# EAGLE design TIVA_SHIELD_Ver_2.3_AD8032_SOIC (EAGLE 9.6.2)
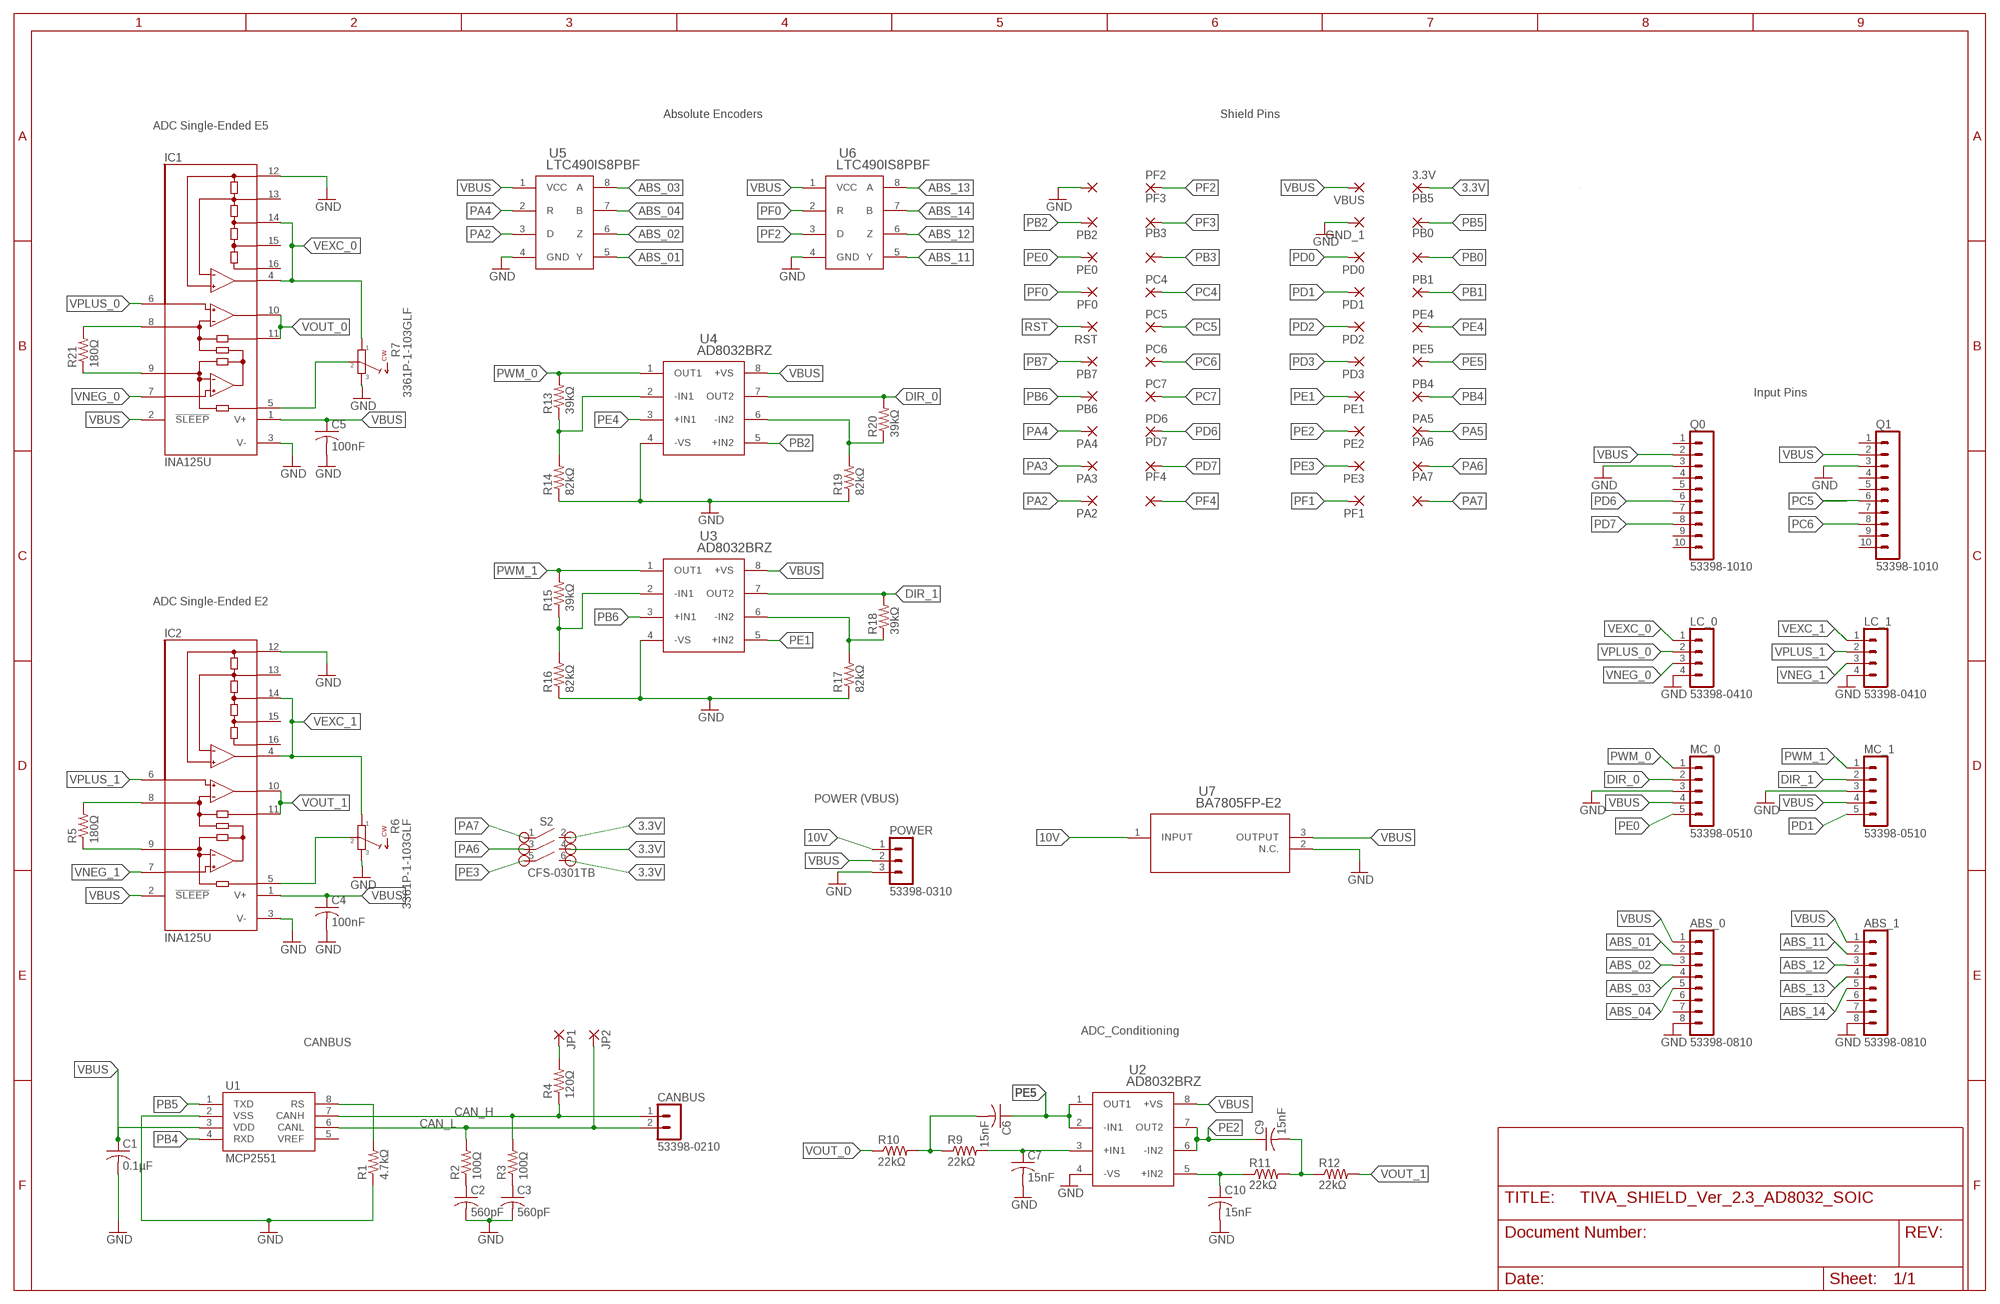
[diagram p0: schematic, sheet 1]

## Parts
3.3V  1,6/0,9  [1,6/0,9]
ABS_0  53398-0810  [53398-0810]
ABS_1  53398-0810  [53398-0810]
C1  0.1µF  C-USC0805  [C0805]
C2  560pF  C-USC0805  [C0805]
C3  560pF  C-USC0805  [C0805]
C4  100nF  C-USC0805  [C0805]
C5  100nF  C-USC0805  [C0805]
C6  15nF  C-USC0805  [C0805]
C7  15nF  C-USC0805  [C0805]
C9  15nF  C-USC0805  [C0805]
C10  15nF  C-USC0805  [C0805]
CANBUS  53398-0210  [53398-0210]
GND_0  1,6/0,9  [1,6/0,9]
GND_1  1,6/0,9  [1,6/0,9]
IC1  INA125U  [SO16-1]
IC2  INA125U  [SO16-1]
JP1  1,6/0,9  [1,6/0,9]
JP2  1,6/0,9  [1,6/0,9]
LC_0  53398-0410  [53398-0410]
LC_1  53398-0410  [53398-0410]
MC_0  53398-0510  [53398-0510]
MC_1  53398-0510  [53398-0510]
PA2  1,6/0,9  [1,6/0,9]
PA3  1,6/0,9  [1,6/0,9]
PA4  1,6/0,9  [1,6/0,9]
PA5  1,6/0,9  [1,6/0,9]
PA6  1,6/0,9  [1,6/0,9]
PA7  1,6/0,9  [1,6/0,9]
PB0  1,6/0,9  [1,6/0,9]
PB1  1,6/0,9  [1,6/0,9]
PB2  1,6/0,9  [1,6/0,9]
PB3  1,6/0,9  [1,6/0,9]
PB4  1,6/0,9  [1,6/0,9]
PB5  1,6/0,9  [1,6/0,9]
PB6  1,6/0,9  [1,6/0,9]
PB7  1,6/0,9  [1,6/0,9]
PC4  1,6/0,9  [1,6/0,9]
PC5  1,6/0,9  [1,6/0,9]
PC6  1,6/0,9  [1,6/0,9]
PC7  1,6/0,9  [1,6/0,9]
PD0  1,6/0,9  [1,6/0,9]
PD1  1,6/0,9  [1,6/0,9]
PD2  1,6/0,9  [1,6/0,9]
PD3  1,6/0,9  [1,6/0,9]
PD6  1,6/0,9  [1,6/0,9]
PD7  1,6/0,9  [1,6/0,9]
PE0  1,6/0,9  [1,6/0,9]
PE1  1,6/0,9  [1,6/0,9]
PE2  1,6/0,9  [1,6/0,9]
PE3  1,6/0,9  [1,6/0,9]
PE4  1,6/0,9  [1,6/0,9]
PE5  1,6/0,9  [1,6/0,9]
PF0  1,6/0,9  [1,6/0,9]
PF1  1,6/0,9  [1,6/0,9]
PF2  1,6/0,9  [1,6/0,9]
PF3  1,6/0,9  [1,6/0,9]
PF4  1,6/0,9  [1,6/0,9]
POWER  53398-0310  [53398-0310]
Q0  53398-1010  [53398-1010]
Q1  53398-1010  [53398-1010]
R1  4.7kΩ  R-US_R0805  [R0805]
R2  100Ω  R-US_R0805  [R0805]
R3  100Ω  R-US_R0805  [R0805]
R4  120Ω  R-US_R0805  [R0805]
R5  180Ω  R-US_R0805  [R0805]
R6  3361P-1-103GLF  3361P-1-103GLFSMD  [3361P-1-103GLF]
R7  3361P-1-103GLF  3361P-1-103GLFSMD  [3361P-1-103GLF]
R9  22kΩ  R-US_R0805  [R0805]
R10  22kΩ  R-US_R0805  [R0805]
R11  22kΩ  R-US_R0805  [R0805]
R12  22kΩ  R-US_R0805  [R0805]
R13  39kΩ  R-US_R0805  [R0805]
R14  82kΩ  R-US_R0805  [R0805]
R15  39kΩ  R-US_R0805  [R0805]
R16  82kΩ  R-US_R0805  [R0805]
R17  82kΩ  R-US_R0805  [R0805]
R18  39kΩ  R-US_R0805  [R0805]
R19  82kΩ  R-US_R0805  [R0805]
R20  39kΩ  R-US_R0805  [R0805]
R21  180Ω  R-US_R0805  [R0805]
RST  1,6/0,9  [1,6/0,9]
S2  CFS-0301TB  CFS-0301TBSMD  [CFS-0301TB]
U1  MCP2551  [SO08]
U2  AD8032BRZ  [R_8_ADI]
U3  AD8032BRZ  [R_8_ADI]
U4  AD8032BRZ  [R_8_ADI]
U5  LTC490IS8PBF  [SO-8_S]
U6  LTC490IS8PBF  [SO-8_S]
U7  BA7805FP-E2  [TO252-3_ROM]
VBUS  1,6/0,9  [1,6/0,9]

## Nets
3.3V: 3.3V.1(P) S2.2 S2.4 S2.6
10V: POWER.1 U7.1(INPUT)
ABS_01: ABS_0.2 U5.5(Y)
ABS_02: ABS_0.3 U5.6(Z)
ABS_03: ABS_0.4 U5.8(A)
ABS_04: ABS_0.5 U5.7(B)
ABS_11: ABS_1.2 U6.5(Y)
ABS_12: ABS_1.3 U6.6(Z)
ABS_13: ABS_1.4 U6.8(A)
ABS_14: ABS_1.5 U6.7(B)
CAN_H: CANBUS.1 R3.2 R4.1 U1.7(CANH)
CAN_L: CANBUS.2 JP2.1(P) R2.2 U1.6(CANL)
DIR_0: MC_0.2 R20.2 U4.7(OUT2)
DIR_1: MC_1.2 R18.2 U3.7(OUT2)
GND: ABS_0.8 ABS_1.8 C1.2 C2.2 C3.2 C4.2 C5.2 C7.2 C10.2 GND_0.1(P) GND_1.1(P) IC1.3(V-) IC1.12(REFCOM) IC2.3(V-) IC2.12(REFCOM) LC_0.4 LC_1.4 MC_0.3 MC_1.3 POWER.3 Q0.3 Q1.3 R1.1 R6.3 R7.3 R14.1 R16.1 R17.1 R19.1 U1.2(VSS) U2.4(-VS) U3.4(-VS) U4.4(-VS) U5.4(GND) U6.4(GND) U7.2(N.C.)
N$1: R1.2 U1.8(RS)
N$4: C2.1 R2.1
N$5: C3.1 R3.1
N$6: JP1.1(P) R4.2
N$7: IC2.9(RG) R5.1
N$8: IC2.8(RG) R5.2
N$9: IC2.5(REF) R6.2
N$10: IC1.9(RG) R21.1
N$11: IC1.8(RG) R21.2
N$12: IC1.5(REF) R7.2
N$13: C10.1 R11.1 U2.5(+IN2)
N$14: C9.2 R11.2 R12.1
N$15: C7.1 R9.2 U2.3(+IN1)
N$16: R19.2 R20.1 U4.6(-IN2)
N$17: R17.2 R18.1 U3.6(-IN2)
N$18: C6.2 R9.1 R10.2
N$19: R13.1 R14.2 U4.2(-IN1)
N$20: R15.1 R16.2 U3.2(-IN1)
PA2: PA2.1(P) U5.3(D)
PA3: PA3.1(P)
PA4: PA4.1(P) U5.2(R)
PA5: PA5.1(P)
PA6: PA6.1(P) S2.3
PA7: PA7.1(P) S2.1
PB0: PB0.1(P)
PB1: PB1.1(P)
PB2: PB2.1(P) U4.5(+IN2)
PB3: PB3.1(P)
PB4: PB4.1(P) U1.4(RXD)
PB5: PB5.1(P) U1.1(TXD)
PB6: PB6.1(P) U3.3(+IN1)
PB7: PB7.1(P)
PC4: PC4.1(P)
PC5: PC5.1(P) Q1.6
PC6: PC6.1(P) Q1.8
PC7: PC7.1(P)
PD0: PD0.1(P)
PD1: MC_1.5 PD1.1(P)
PD2: PD2.1(P)
PD3: PD3.1(P)
PD6: PD6.1(P) Q0.6
PD7: PD7.1(P) Q0.8
PE0: MC_0.5 PE0.1(P)
PE1: PE1.1(P) U3.5(+IN2)
PE2: C9.1 PE2.1(P) U2.6(-IN2) U2.7(OUT2)
PE3: PE3.1(P) S2.5
PE4: PE4.1(P) U4.3(+IN1)
PE5: C6.1 PE5.1(P) U2.1(OUT1) U2.2(-IN1)
PF0: PF0.1(P) U6.2(R)
PF1: PF1.1(P)
PF2: PF2.1(P) U6.3(D)
PF3: PF3.1(P)
PF4: PF4.1(P)
PWM_0: MC_0.1 R13.2 U4.1(OUT1)
PWM_1: MC_1.1 R15.2 U3.1(OUT1)
RST: RST.1(P)
VBUS: ABS_0.1 ABS_1.1 C1.1 C4.1 C5.1 IC1.1(V+) IC1.2(!SLEEP) IC2.1(V+) IC2.2(!SLEEP) MC_0.4 MC_1.4 POWER.2 Q0.2 Q1.2 U1.3(VDD) U2.8(+VS) U3.8(+VS) U4.8(+VS) U5.1(VCC) U6.1(VCC) U7.3(OUTPUT) VBUS.1(P)
VEXC_0: IC1.4(REFOUT) IC1.14(REF2.5) LC_0.1 R7.1
VEXC_1: IC2.4(REFOUT) IC2.14(REF2.5) LC_1.1 R6.1
VNEG_0: IC1.7(-IN) LC_0.3
VNEG_1: IC2.7(-IN) LC_1.3
VOUT_0: IC1.10(OUT) IC1.11(SENSE) R10.1
VOUT_1: IC2.10(OUT) IC2.11(SENSE) R12.2
VPLUS_0: IC1.6(+IN) LC_0.2
VPLUS_1: IC2.6(+IN) LC_1.2
Unconnected: ABS_0.6 ABS_0.7 ABS_1.6 ABS_1.7 IC1.13(REFBG) IC1.15(REF5) IC1.16(REF10) IC2.13(REFBG) IC2.15(REF5) IC2.16(REF10) Q0.1 Q0.4 Q0.5 Q0.7 Q0.9 Q0.10 Q1.1 Q1.4 Q1.5 Q1.7 Q1.9 Q1.10 U1.5(VREF)

## Notes on the sheet
- Absolute Encoders | Shield Pins
- ADC Single-Ended E5
- Input Pins
- ADC Single-Ended E2
- POWER (VBUS)
- ADC_Conditioning
- CANBUS

## Library data of the parts
3.3V GND_0 GND_1 JP1 JP2 PA2-PA7 PB0 PB1-PB7 PC4-PC7 PD0 PD1-PD3 PD6 PD7 PE0 PE1-PE5 PF0 PF1-PF4 RST VBUS = wirepad:1,6/0,9: THROUGH-HOLE PAD
ABS_0 ABS_1 = con-molex-picoblade:53398-0810: HEADER
C1-C7 C9 C10 = rcl:C-US: CAPACITOR, American symbol; SPICEPREFIX: C
CANBUS = con-molex-picoblade:53398-0210: HEADER
IC1 IC2 = burr-brown_1:INA125: Instrumentation Amplifier with Precision Voltage Reference; MF: TEXAS INSTRUMENT CONNECTORS; MPN: INA125U; OC_FARNELL: 1304375; OC_NEWARK: 80K5901
LC_0 LC_1 = con-molex-picoblade:53398-0410: HEADER
MC_0 MC_1 = con-molex-picoblade:53398-0510: HEADER
POWER = con-molex-picoblade:53398-0310: HEADER
Q0 Q1 = con-molex-picoblade:53398-1010: HEADER
R1-R5 R9-R21 = rcl:R-US_: RESISTOR, American symbol; SPICEPREFIX: R
R6 R7 = TREC_Library:3361P-1-103GLF: Bourns Surface Mount Trimmer Potentiometer
S2 = TREC_Library:CFS-0301TB: CFS Slide Switches 3 Position Slide Switch CFS-0301TB CFS = Series Name 03 = Number of bits 01 = Flat Knob non washable type T = Packing = Taping B = Gull Wing CFS DATASHEET <https://www.nidec-copal-electronics.com/e/catalog/switch/cfs.pdf>
U1 = SparkFun-IC-Comms:MCP2551: MCP2551 High Speed CAN Transceiver High speed CAN transceiver Datasheet <http://www.sparkfun.com/datasheets/DevTools/Arduino/MCP2551.pdf> SparkFun Products CAN-BUS Shield <https://www.sparkfun.com/products/13262> (DEV-13262) SparkFun OBD-II UART <https://www.sparkfun.com/products/9555> (WIG-09555); PROD_ID: IC-09907
U2-U4 = AD8032BRZ:AD8032BRZ; COPYRIGHT: Copyright (C) 2021 Ultra Librarian. All rights reserved.; MANUFACTURER_PART_NUMBER: AD8032BRZ; MFR_NAME: Analog Devices Inc
U5 U6 = LTC490:LTC490IS8PBF; MANUFACTURER_PART_NUMBER: LTC490IS8#PBF; VENDOR: Linear Technology
U7 = Rohm_Semiconductors:BA7805FP-E2; COPYRIGHT: Copyright (C) 2021 Ultra Librarian. All rights reserved.; MANUFACTURER_PART_NUMBER: BA7805FP-E2; MFR_NAME: ROHM Semiconductor

## Board
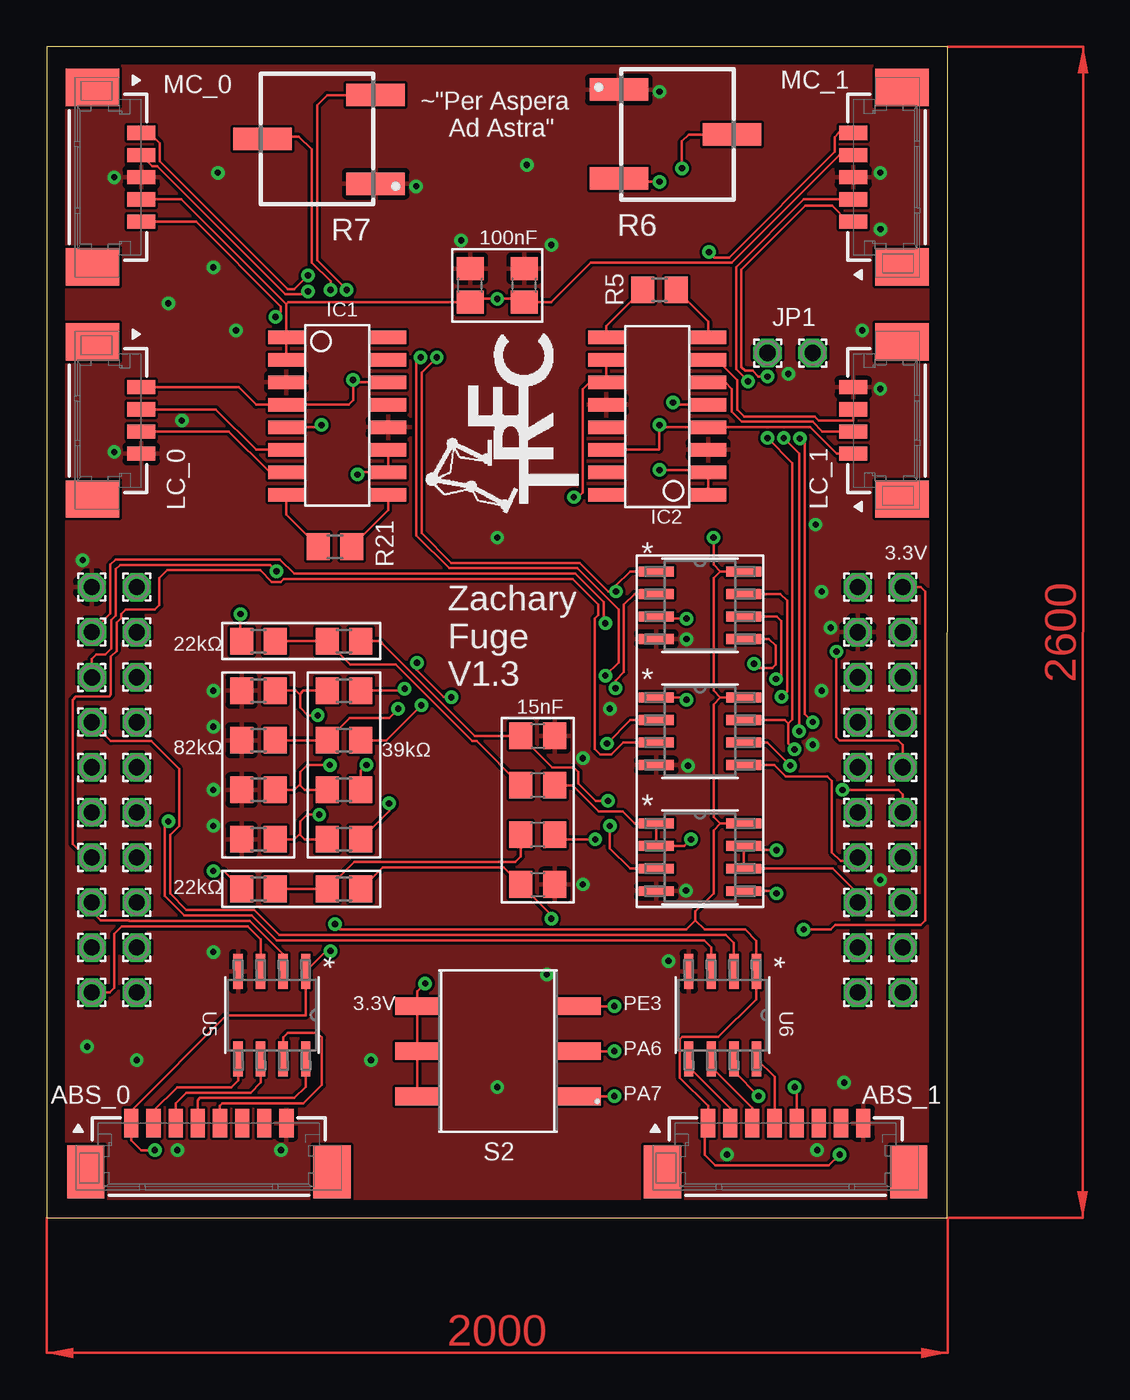
[diagram p1: board, top side]
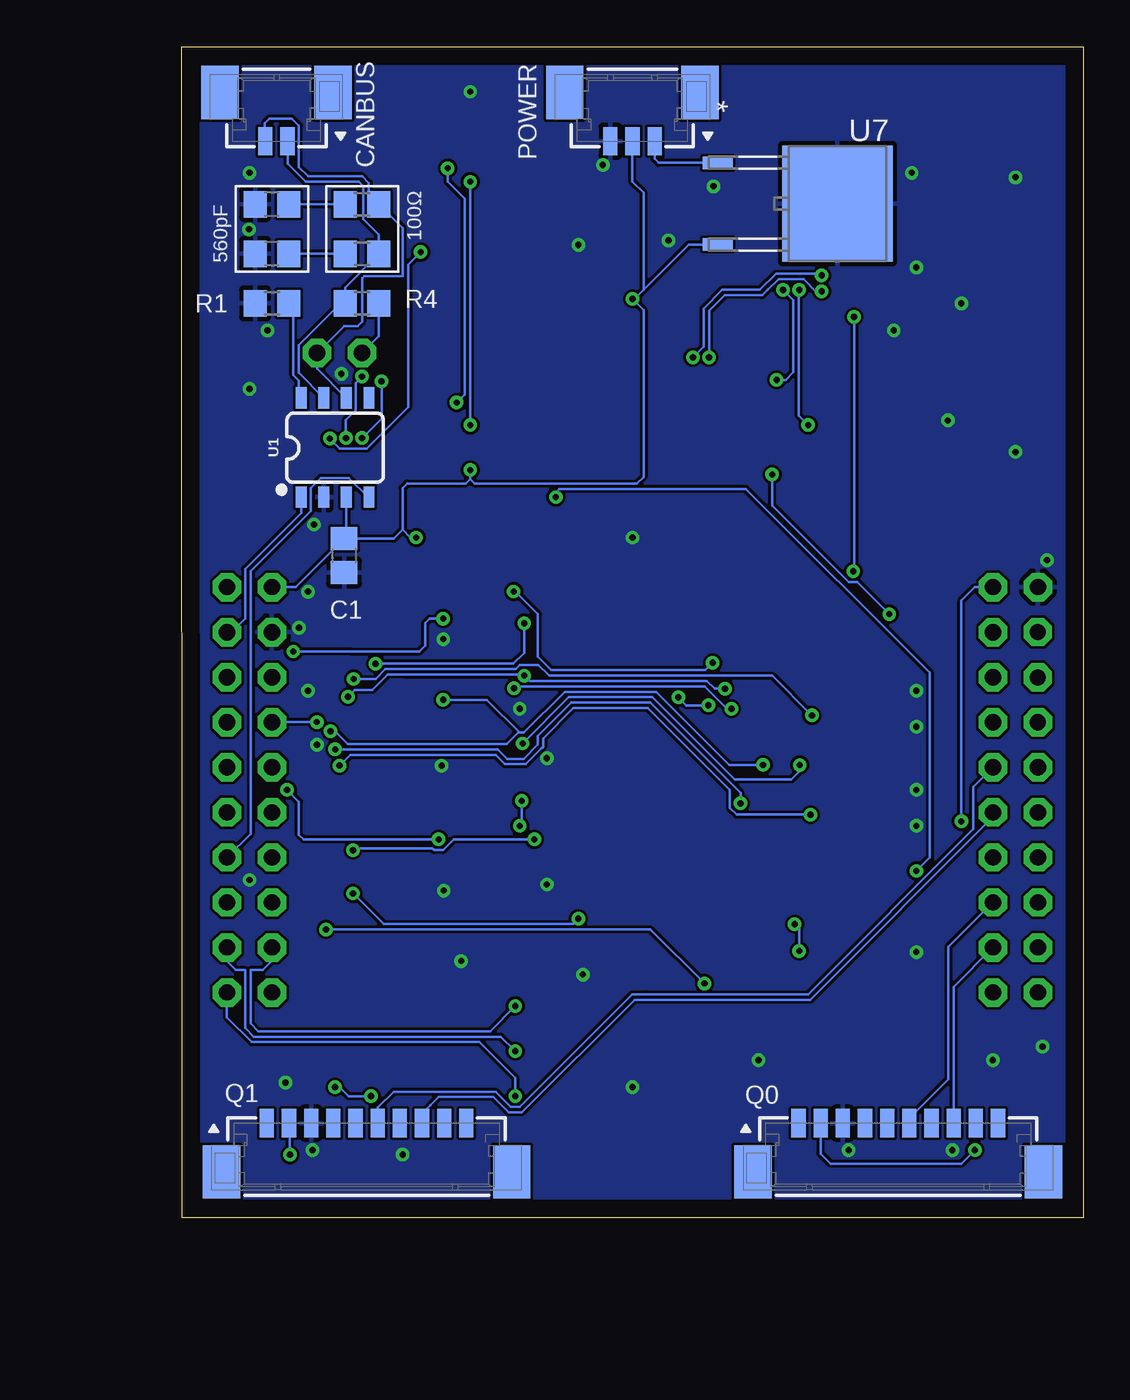
[diagram p2: board, bottom side, seen from below]

Size 50.81 x 66.04 mm. Coordinates in mm from the lower left corner, seen from the top.
Outline: 0,0 50.78,0 50.8,66.04 0,66.04 0,0
Copper layers (1*16): Top 0.035mm / dielectric 1.5mm / Bottom 0.035mm
Design rules "default": minimum track width 6mil, minimum drill 0.35mm, track to track 6mil, track to pad 6mil, pad to pad 6mil, via to via 6mil, smd to smd 6mil, copper to edge 40mil, drill to drill 6mil, minimum pad ring 10mil, minimum via ring 8mil, stop-mask expansion 4mil, vias tented up to drill 0mil, thermal gap 10mil

### Footprints (pad centres in the part's own frame; a part is rotated, then mirrored left to right if it is on the bottom)
1,6/0,9 = drill 0.914 pad 1.6 octagon: 1 0,0
53398-0810 = smd 0.8 x 1.6: 1 4.375,0; 2 3.125,0; 3 1.875,0; 4 0.625,0; 5 -0.625,0; 6 -1.875,0; 7 -3.125,0; 8 -4.375,0 | smd 2.1 x 3: M1 6.935,2.75; M2 -6.935,2.75
C0805 = smd 1.3 x 1.5: 1 -0.95,0; 2 0.95,0
53398-0210 = smd 0.8 x 1.6: 1 0.625,0; 2 -0.625,0 | smd 2.1 x 3: M1 3.185,2.75; M2 -3.185,2.75
SO16-1 = smd 0.762 x 2.032: 1 -4.445,-4.775; 2 -3.175,-4.775; 3 -1.905,-4.775; 4 -0.635,-4.775; 5 0.635,-4.775; 6 1.905,-4.775; 7 3.175,-4.775; 8 4.445,-4.775; 9 4.445,0.965; 10 3.175,0.965; 11 1.905,0.965; 12 0.635,0.965; 13 -0.635,0.965; 14 -1.905,0.965; 15 -3.175,0.965; 16 -4.445,0.965
53398-0410 = smd 0.8 x 1.6: 1 1.875,0; 2 0.625,0; 3 -0.625,0; 4 -1.875,0 | smd 2.1 x 3: M1 4.435,2.75; M2 -4.435,2.75
53398-0510 = smd 0.8 x 1.6: 1 2.5,0; 2 1.25,0; 3 0,0; 4 -1.25,0; 5 -2.5,0 | smd 2.1 x 3: M1 5.06,2.75; M2 -5.06,2.75
53398-0310 = smd 0.8 x 1.6: 1 1.25,0; 2 0,0; 3 -1.25,0 | smd 2.1 x 3: M1 3.81,2.75; M2 -3.81,2.75
53398-1010 = smd 0.8 x 1.6: 1 5.625,0; 2 4.375,0; 3 3.125,0; 4 1.875,0; 5 0.625,0; 6 -0.625,0; 7 -1.875,0; 8 -3.125,0; 9 -4.375,0; 10 -5.625,0 | smd 2.1 x 3: M1 8.185,2.75; M2 -8.185,2.75
R0805 = smd 1.3 x 1.5: 1 -0.95,0; 2 0.95,0
3361P-1-103GLF = smd 1.27 x 3.302: 1 2.353,-3.294; 2 -0.116,3.076; 3 -2.66,-3.301
CFS-0301TB = smd 1 x 2.5: 1 0.5,1.25; 2 0.5,10.35; 3 3.04,1.25; 4 3.04,10.35; 5 5.58,1.25; 6 5.58,10.35
SO08 = smd 0.6 x 1.2: 1 -1.905,-2.8; 2 -0.635,-2.8; 3 0.635,-2.8; 4 1.905,-2.8; 5 1.905,2.8; 6 0.635,2.8; 7 -0.635,2.8; 8 -1.905,2.8
R_8_ADI = smd 1.981 x 0.559: 1 -2.464,1.905; 2 -2.464,0.635; 3 -2.464,-0.635; 4 -2.464,-1.905; 5 2.464,-1.905; 6 2.464,-0.635; 7 2.464,0.635; 8 2.464,1.905
SO-8_S = smd 1.981 x 0.533: 1 -2.464,1.905; 2 -2.464,0.635; 3 -2.464,-0.635; 4 -2.464,-1.905; 5 2.464,-1.905; 6 2.464,-0.635; 7 2.464,0.635; 8 2.464,1.905
TO252-3_ROM = smd 0.711 x 1.702: 1 -2.3,-6.756; 3 2.3,-6.756 | smd 6.553 x 6.223: 2 0,0

### Placement (x,y rotation side)
3.3V  48.26,35.56 0 top
ABS_0  9.14,5.33 180 top
ABS_1  41.66,5.33 180 top
C1  41.66,37.34 270 bottom
C2  45.72,57.15 180 bottom
C3  45.72,54.36 180 bottom
C4  26.92,52.58 90 top
C5  23.88,52.58 90 top
C6  27.69,24.38 180 top
C7  27.69,27.18 0 top
C9  27.69,21.59 180 top
C10  27.69,18.8 0 top
CANBUS  45.47,60.71 0 bottom
GND_0  2.54,35.56 0 top
GND_1  45.72,33.02 0 top
IC1  18.29,45.21 270 top
IC2  32.51,45.21 90 top
JP1  40.64,48.77 90 top
JP2  43.18,48.77 90 top
LC_0  5.33,44.96 90 top
LC_1  45.47,44.96 270 top
MC_0  5.33,58.67 90 top
MC_1  45.47,58.67 270 top
PA2  2.54,12.7 0 top
PA3  2.54,15.24 0 top
PA4  2.54,17.78 0 top
PA5  48.26,17.78 0 top
PA6  48.26,15.24 0 top
PA7  48.26,12.7 0 top
PB0  48.26,30.48 0 top
PB1  48.26,27.94 0 top
PB2  2.55,33.03 0 top
PB3  5.08,30.48 0 top
PB4  48.26,20.32 0 top
PB5  48.26,33.02 0 top
PB6  2.54,20.32 0 top
PB7  2.54,22.86 0 top
PC4  5.08,27.94 0 top
PC5  5.08,25.4 0 top
PC6  5.08,22.86 0 top
PC7  5.08,20.32 0 top
PD0  45.72,30.48 0 top
PD1  45.72,27.94 0 top
PD2  45.72,25.4 0 top
PD3  45.72,22.86 0 top
PD6  5.08,17.78 0 top
PD7  5.08,15.24 0 top
PE0  2.55,30.47 0 top
PE1  45.72,20.32 0 top
PE2  45.72,17.78 0 top
PE3  45.72,15.24 0 top
PE4  48.26,25.4 0 top
PE5  48.26,22.86 0 top
PF0  2.55,27.95 0 top
PF1  45.72,12.7 0 top
PF2  5.08,35.56 0 top
PF3  5.08,33.02 0 top
PF4  5.08,12.7 0 top
POWER  25.4,60.71 0 bottom
Q0  10.41,5.33 180 bottom
Q1  40.39,5.33 180 bottom
R1  45.72,51.56 0 bottom
R2  40.64,57.15 0 bottom
R3  40.64,54.36 0 bottom
R4  40.64,51.56 0 bottom
R5  34.54,52.32 0 top
R6  35.56,60.96 270 top
R7  15.24,60.96 90 top
R9  16.76,32.51 0 top
R10  11.94,32.51 0 top
R11  16.76,18.54 180 top
R12  11.94,18.54 180 top
R13  16.76,26.92 0 top
R14  11.94,26.92 0 top
R15  16.76,24.13 0 top
R16  11.94,24.13 0 top
R17  11.94,21.34 0 top
R18  16.76,21.34 0 top
R19  11.94,29.72 0 top
R20  16.76,29.72 0 top
R21  16.26,37.85 180 top
RST  2.54,25.4 0 top
S2  31.24,6.35 90 top
U1  42.16,43.43 0 bottom
U2  36.83,20.32 0 top
U3  36.83,27.43 0 top
U4  36.83,34.54 0 top
U5  12.7,11.43 270 top
U6  38.1,11.43 270 top
U7  13.84,57.19 270 bottom
VBUS  45.72,35.56 0 top

### Tracks (layer width: path | path; a pad name or v marks a point on that pad's centre or on a via)
3.3V  (via drill 0.35)
  Top 0.152: S2.2 S2.4 S2.6 20.89,12.76 v21.34,13.21 | v42.67,16.26 44.2,16.26 44.45,16.51 49.28,16.51 49.53,16.76 49.53,35.31 49.28,35.56 3.3V.1
  Bottom 0.152: v21.34,13.21 24.38,16.26 v42.67,16.26
10V
  Bottom 0.152: U7.1 23.93,59.49 24.15,59.71 POWER.1
ABS_01
  Top 0.152: ABS_0.2 6.02,6.02 7.36,7.36 10.41,7.36 10.8,7.74 U5.5
ABS_02
  Top 0.152: ABS_0.3 7.27,6.45 7.87,7.05 11.5,7.05 12.06,7.62 U5.6
ABS_03
  Top 0.152: ABS_0.4 8.52,6.63 8.64,6.75 13.97,6.75 14.61,7.38 U5.8
ABS_04
  Top 0.152: ABS_0.5 9.77,6.31 9.91,6.44 14.48,6.44 15.52,7.49 15.52,10.16 15.27,10.41 13.59,10.41 13.34,10.16 U5.7
ABS_11
  Top 0.152: ABS_1.2 38.53,6.17 36.2,8.51 U6.5
ABS_12
  Top 0.152: ABS_1.3 39.78,6.19 37.47,8.51 U6.6
ABS_13
  Top 0.152: ABS_1.4 41.03,7.94 U6.8
ABS_14  (via drill 0.35)
  Top 0.152: U6.7 38.75,8.95 38.75,8.24 v40.13,6.86 | v42.16,7.37 42.28,7.25 ABS_1.5
  Bottom 0.152: v40.13,6.86 41.4,6.86 41.91,7.37 v42.16,7.37
CAN_H
  Bottom 0.152: U1.7 44.21,47.64 44.21,49.19 41.84,51.56 R4.1 41.59,52.46 R3.2 39.69,55.43 40.57,56.3 40.57,58.17 40.82,58.42 43.81,58.42 44.84,59.45 CANBUS.1
CAN_L
  Bottom 0.152: CANBUS.2 46.12,60.73 46.12,61.72 45.86,61.98 44.59,61.98 44.2,61.58 44.2,59.23 43.69,58.73 40.64,58.73 40.26,58.35 40.26,57.72 R2.2 38.35,55.81 38.35,53.09 40.53,53.09 40.64,52.98 40.64,50.55 40.89,50.29 41.66,50.29 JP2.1 43.18,47.88 U1.6
DIR_0  (via drill 0.35)
  Top 0.152: v21.08,48.51 20.83,48.26 20.83,38.48 22.68,36.63 29.92,36.63 32.24,34.31 32.24,31.31 v31.5,30.57 | v14.73,52.23 14.57,52.07 13.46,52.07 6.23,59.3 5.96,59.3 MC_0.2 | R20.2 20.07,29.72 v20.18,29.84 | U4.7 41.36,35.18 41.74,34.8 41.74,29.68 v41.44,29.38
  Bottom 0.152: v21.08,48.51 21.08,51.15 20.21,52.02 18.09,52.02 17.78,52.32 17.77,52.32 17.16,52.93 15.75,52.93 15.05,52.23 v14.73,52.23 | v20.18,29.84 20.77,29.84 21.2,30.27 31.19,30.27 v31.5,30.57 31.55,30.63 38.1,30.63 38.19,30.63 39.2,30.63 40.06,29.77 41.05,29.77 v41.44,29.38
DIR_1  (via drill 0.35)
  Top 0.152: v40.64,43.97 42.04,42.57 42.04,28.09 41.81,27.86 | v39.54,47.17 38.86,47.84 38.86,53.59 42.69,57.42 MC_1.2 | R18.2 19.3,22.93 v19.3,23.37 | 41.81,27.86 41.81,26.75 v42.16,26.41 | U3.7 41.6,28.07 41.81,27.86
  Bottom 0.152: v40.64,43.97 39.54,45.07 v39.54,47.17 | v19.3,23.37 19.3,23.95 24.4,29.05 28.85,29.05 30.74,27.16 30.74,26.68 31.54,25.88 32.46,25.88 32.99,26.41 v42.16,26.41
GND  (via drill 0.35)
  other vias: 43.43,3.81 9.4,14.99 13.21,3.81 9.4,22.1 9.4,24.13 9.4,27.69 9.4,29.72 2.03,37.08 43.69,35.31 44.2,33.27 28.45,54.86 23.37,55.12 27.07,59.37 20.83,58.17 34.54,63.5 46.99,58.93 46.99,46.74 3.81,58.67 9.65,58.93 6.86,51.56 10.67,50.04 3.81,43.18 35.05,14.48 30.23,25.91 30.23,18.8 47.01,55.74 45.97,50.04 43.35,39.09 38.35,3.56 7.37,3.81 43.69,29.72 43.18,26.67 41.81,47.59 31.75,28.7 46.99,19.05 7.62,44.96 44.96,7.62 28.19,13.72 25.4,7.37 18.29,8.89 5.08,8.89 2.29,9.65 25.4,38.35 9.4,53.59 36.07,32.63 36.15,25.49 36.04,18.45
  pour Top: -4.06,68.07 55.37,68.07 61.98,61.47 61.98,5.33 54.86,-1.78 -1.52,-1.78 -5.33,2.03 -5.33,66.8
  pour Bottom: -7.62,68.83 -7.62,2.03 0.51,-6.1 53.09,-6.1 66.29,7.11 66.29,60.71 53.34,73.66 -2.79,73.66
N$1
  Bottom 0.152: U1.8 44.2,46.36 44.2,47.2 44.51,47.52 44.51,51.31 R1.2
N$4
  Bottom 0.152: C2.1 R2.1
N$5
  Bottom 0.152: R3.1 C3.1
N$6
  Bottom 0.152: JP1.1 39.69,49.72 R4.2
N$7
  Top 0.152: R5.1 31.55,50.28 IC2.9
N$8
  Top 0.152: R5.2 37.29,50.53 IC2.8
N$9  (via drill 0.35)
  Top 0.152: IC2.5 35.43,45.85 v35.31,45.97 | v35.81,59.18 35.81,60.71 36.18,61.08 R6.2
  Bottom 0.152: v35.31,45.97 34.85,46.43 34.85,57.45 35.81,58.42 v35.81,59.18
N$10
  Top 0.152: R21.1 19.25,39.89 IC1.9
N$11
  Top 0.152: R21.2 13.51,39.64 IC1.8
N$12  (via drill 0.35)
  Top 0.152: IC1.5 15.37,44.58 v15.49,44.7 | v16,52.32 16,52.8 14.94,53.87 14.94,60.25 14.22,60.96 12.28,60.96 R7.2
  Bottom 0.152: v15.49,44.7 16.03,45.24 16.03,52.3 v16,52.32
N$13  (via drill 0.35)
  Top 0.152: R11.1 18.93,19.76 25.77,19.76 C10.1 28.45,17.08 v28.45,16.86 | U2.5 41.02,18.41 v41.15,18.29
  Bottom 0.152: v41.15,18.29 39.42,16.56 28.75,16.56 v28.45,16.86
N$14
  Top 0.152: R12.1 R11.2 17.34,20.07 26.42,20.07 26.74,20.39 C9.2
N$15  (via drill 0.35)
  Top 0.152: v31.64,23.51 30.96,23.51 29.97,24.5 29.97,25.15 29.72,25.4 28.51,25.4 C7.1 24.13,27.18 18.92,32.38 18.92,32.39 18.8,32.51 R9.2 | U2.3 32.89,19.68 31.75,20.83 v31.75,22.1
  Bottom 0.152: v31.64,23.51 31.64,23.37 31.64,23.16 31.64,22.21 v31.75,22.1
N$16  (via drill 0.35)
  Top 0.152: R20.1 14.48,29.72 14.28,29.52 14.28,29.46 | R19.2 14.03,29.72 14.28,29.46 | v15.28,28.33 14.73,28.33 14.28,28.78 14.28,29.46 | U4.6 41.15,33.91 41.4,33.66 41.4,30.48 41.3,30.38 v41.12,30.38
  Bottom 0.152: v15.28,28.33 17.53,30.57 30.1,30.57 30.7,31.18 31.75,31.18 31.99,30.94 39.33,30.94 39.88,30.38 v41.12,30.38
N$17  (via drill 0.35)
  Top 0.152: R18.1 14.56,21.34 14.31,21.59 14.31,21.67 | R17.2 13.97,21.34 14.31,21.67 | 14.31,21.67 14.31,22.35 14.68,22.73 v15.37,22.73 | U3.6 40.61,26.8 v41.91,25.5
  Bottom 0.152: v15.37,22.73 19.52,22.73 19.91,23.12 19.91,24.13 24.53,28.74 28.73,28.74 30.44,27.03 30.44,26.55 30.53,26.46 | 30.53,26.46 31.41,25.58 32.59,25.58 33.11,26.1 41.31,26.1 v41.91,25.5 | 30.53,26.46
N$18
  Top 0.152: R10.2 R9.1 17.12,31.2 19.67,31.2 24,26.87 24.25,26.87 C6.2
N$19  (via drill 0.35)
  Top 0.152: R14.2 R13.1 17.08,28.19 19.3,28.19 v19.81,28.7 | U4.2 33.15,35.18 32.55,34.58 32.55,30.76 32.07,30.29 v32.07,29.86
  Bottom 0.152: v19.81,28.7 20.07,28.7 21.33,29.96 31.97,29.96 v32.07,29.86
N$20  (via drill 0.35)
  Top 0.152: R15.1 14.56,24.13 14.31,24.38 14.31,24.47 | R16.2 13.97,24.13 14.31,24.47 | 14.31,24.47 14.31,25.15 14.69,25.53 v15.97,25.53 | v31.59,26.74 32.91,28.07 U3.2
  Bottom 0.152: v31.59,26.74 28.98,29.35 24.27,29.35 19.64,24.72 16.44,24.72 15.97,25.2 v15.97,25.53
PA2
  Top 0.152: U5.3 12.06,15.7 11.34,16.43 4.24,16.43 3.81,16 3.81,12.95 3.56,12.7 PA2.1
PA4
  Top 0.152: U5.2 13.34,14.86 11.44,16.75 4.65,16.75 4.64,16.76 3.05,16.76 2.54,17.27 PA4.1
PA6  (via drill 0.35)
  Top 0.152: S2.3 v32,9.39 v32,9.4
  Bottom 0.152: PA6.1 48.26,14.48 47.75,13.97 47.24,13.97 47.23,13.96 47.23,10.71 46.74,10.21 32.82,10.21 v32,9.4
PA7  (via drill 0.35)
  Top 0.152: S2.1 v32,6.85 v32,6.86
  Bottom 0.152: PA7.1 48.26,11.3 46.86,9.91 34.04,9.91 32,7.87 v32,6.86
PB2  (via drill 0.35)
  Top 0.152: PB2.1 3.59,34.07 3.59,36.83 3.88,37.12 13.15,37.12 13.95,36.32 29.8,36.32 31.41,34.71 31.41,33.62 v31.5,33.53 | U4.5 40.72,32.64 41.1,32.26 41.1,31.19 40.89,30.99 40.13,30.99 v39.88,31.24
  Bottom 0.152: v31.5,33.53 31.5,31.86 32.11,31.24 v39.88,31.24
PB4
  Bottom 0.152: U1.4 40.31,40.63 41.39,41.72 42.97,41.72 43.54,41.15 43.54,39.85 46.92,36.46 46.92,21.66 PB4.1
PB5
  Bottom 0.152: U1.1 44.07,39.75 47.23,36.59 47.23,34.58 47.23,33.78 47.99,33.02 PB5.1
PB6
  Top 0.152: PB6.1 2.22,20.32 1.46,21.08 1.46,29.21 1.64,29.39 3.52,29.39 3.62,29.49 3.62,31.64 3.95,31.97 3.95,33.57 4.2,33.82 4.2,34.04 4.46,34.29 6.1,34.29 6.35,34.54 6.35,36.07 6.79,36.51 12.04,36.51 12.7,35.85 13.21,35.85 13.37,36.02 29.67,36.02 31.1,34.58 31.1,33.99 30.89,33.78 30.89,26.44 31.2,26.14 31.84,26.14 32.5,26.8 U3.3
PC5
  Bottom 0.152: PC5.1 6.18,24.3 6.18,21.92 15.5,12.6 24.64,12.6 24.74,12.6 25.4,12.6 31.75,6.25 32.26,6.25 33.12,7.11 38.86,7.11 39.76,6.21 Q1.6
PC6
  Bottom 0.152: PC6.1 5.08,22.59 15.37,12.3 25.28,12.3 31.63,5.95 32.38,5.95 33.24,6.81 36.32,6.81 36.8,6.33 37.26,5.87 Q1.8
PD1  (via drill 0.35)
  Top 0.152: MC_1.5 44.66,61.17 44.43,60.94 44.43,60.1 38.48,54.15 37.64,54.15 v37.34,54.45 | v43.19,27.95 42.72,28.41 42.72,43.68 v42.46,43.94
  Bottom 0.152: v37.34,54.45 38.05,53.74 38.05,45.7 40.39,43.36 41.91,43.36 42.46,43.91 v42.46,43.94 | v43.19,27.95 PD1.1
PD6
  Bottom 0.152: PD6.1 7.59,15.27 7.59,7.8 9.79,5.61 Q0.6
PD7
  Bottom 0.152: Q0.8 7.29,13.03 PD7.1
PE0  (via drill 0.35)
  Top 0.152: MC_0.5 8.42,56.17 13.21,51.38 13.21,51.1 v12.91,50.8 | v12.95,36.46 12.6,36.82 4.14,36.82 3.9,36.58 3.9,33.95 3.64,33.69 3.64,32.09 3.3,31.75 2.79,31.75 2.54,31.5 2.54,30.48 PE0.1
  Bottom 0.152: v12.91,50.8 12.91,36.51 v12.95,36.46
PE1
  Top 0.152: PE1.1 45.51,20.11 44.75,20.11 44.26,20.61 44.26,24.64 44.01,24.89 41.66,24.89 41.02,25.53 U3.5
PE2  (via drill 0.35)
  Top 0.152: v30.93,21.34 28.89,21.34 C9.1 | PE2.1 45.72,18.29 44.32,19.68 U2.6 U2.7 39.52,20.73 v41.15,20.73
  Bottom 0.152: v30.93,21.34 35.46,21.34 36.07,20.73 36.57,20.73 36.67,20.83 41.05,20.83 v41.15,20.73
PE3  (via drill 0.35)
  Top 0.152: S2.5 v32,11.93 v32,11.94
  Bottom 0.152: v32,11.94 33.43,10.52 46.48,10.52 46.93,10.96 46.93,13.97 46.23,13.97 45.72,14.48 PE3.1
PE4  (via drill 0.35)
  Top 0.152: v44.52,31.93 44.52,27.11 44.72,26.91 48.02,26.91 48.26,26.67 PE4.1 | v36.07,33.78 34.49,33.78 U4.3
  Bottom 0.152: v44.52,31.93 41.4,31.93 41.3,31.93 37.41,31.93 37.08,32.26 37.08,33.53 36.83,33.78 v36.07,33.78
PE5  (via drill 0.35)
  Top 0.152: PE5.1 48.26,23.88 48.01,24.13 v44.87,24.13 | C6.1 29.65,24.38 31.13,22.9 32.47,22.9 33.15,22.23 U2.1 U2.2 35.94,20.95 v36.32,21.34
  Bottom 0.152: v44.87,24.13 44.2,23.46 44.2,21.59 43.94,21.34 v36.32,21.34
PF0
  Top 0.152: U6.2 38.73,15.49 38.28,15.95 13.11,15.95 11.7,17.36 7.87,17.36 6.96,18.28 6.96,21.59 7.46,22.1 7.46,25.3 5.89,26.87 3.62,26.87 PF0.1
PF2  (via drill 0.35)
  Top 0.152: U6.3 37.47,15.24 37.06,15.65 12.98,15.65 11.57,17.06 7.75,17.06 6.65,18.15 6.65,22.15 v6.86,22.35
  Bottom 0.152: v6.86,22.35 6.86,34.8 6.1,35.56 PF2.1
PWM_0  (via drill 0.35)
  Top 0.152: v21.99,48.51 21.13,47.66 21.13,38.61 22.81,36.93 29.97,36.93 30.05,36.93 31.66,35.31 v32.09,35.31 32.09,35.65 32.89,36.45 U4.1 | MC_0.1 5.8,61.17 6.37,60.6 6.37,59.59 13.59,52.38 13.97,52.38 v14.73,53.14 | R13.2 19.15,26.92 v21.12,28.9 | v22.81,29.36 22.38,29.36 20.83,30.91 20.83,31.24 v20.88,31.29
  Bottom 0.152: v21.99,48.51 21.39,49.12 21.39,51.27 20.34,52.32 18.21,52.32 17.3,53.24 14.82,53.24 v14.73,53.14 | v21.12,28.9 22.35,28.9 v22.81,29.36 | v20.88,31.29 21.29,30.88 29.97,30.88 30.73,31.64 30.73,34.04 32.01,35.31 v32.09,35.31
PWM_1  (via drill 0.35)
  Top 0.152: v40.64,47.44 40.13,47.44 39.79,47.77 39.37,47.77 39.17,47.98 39.17,53.47 42.76,57.06 44.28,57.06 45.17,56.17 MC_1.1 | R15.2 17.71,25.22 v18.03,25.54 | v41.55,43.97 42.42,43.1 v42.42,27.43 | U3.1 35.94,29.34 v36.07,29.21
  Bottom 0.152: v41.55,43.97 41.55,44.99 41,45.54 41,47.08 v40.64,47.44 | v18.03,25.54 19.95,25.54 24.07,29.66 29.21,29.66 31.52,27.35 31.75,27.35 | 31.75,27.35 31.84,27.35 32.48,26.71 41.45,26.71 42.16,27.43 v42.42,27.43 | 31.75,27.35 33.61,29.21 v36.07,29.21
VBUS  (via drill 0.35)
  Top 0.152: IC1.2 IC1.1 13.51,51.51 | IC2.1 IC2.2 37.16,42.16 v34.54,42.16 | 13.51,51.51 13.63,51.63 C5.1 24.06,51.82 v25.4,51.82 26.74,51.82 C4.1 28.45,51.63 30.67,53.85 38.61,53.85 44.68,59.92 MC_1.4 | MC_0.4 7.6,57.42 13.51,51.51 | v16,15.04 15.75,15.04 U5.1 14.61,11.42 14.59,11.4 10.13,11.4 4.77,6.04 ABS_0.1 4.77,4.38 5.33,3.81 v6.1,3.81 | v16.26,16.56 16.56,16.26 36.07,16.26 36.58,16.76 | 36.58,16.76 37.08,16.26 39.37,16.26 40.01,15.62 U6.1 40.01,12.32 37.87,10.19 35.83,10.19 35.7,10.05 35.7,7.88 37.28,6.3 ABS_1.1 37.08,5.14 37.08,3.56 37.69,2.95 44.1,2.95 v44.7,3.56 | v37.59,38.35 37.59,36.83 37.97,36.45 | 37.97,36.45 37.59,36.07 37.59,29.72 37.97,29.34 | 37.97,29.34 37.59,28.96 37.59,22.61 37.97,22.23 | 37.97,22.23 37.59,21.84 37.59,18.29 36.58,17.27 36.58,16.76 | 37.97,36.45 U4.8 | 37.97,29.34 U3.8 | 37.97,22.23 U2.8
  Bottom 0.152: C1.1 38.86,38.29 38.35,38.8 | U1.3 41.53,38.41 C1.1 | C1.1 44.38,35.56 VBUS.1 | v34.54,42.16 34.54,41.66 | v16,15.04 16,16.3 v16.26,16.56 | 34.54,41.66 34.29,41.4 25.15,41.4 24.77,41.77 24.77,51.19 v25.4,51.82 25.28,51.82 24.77,52.32 | 34.54,41.66 34.8,41.4 38.1,41.4 38.35,41.15 38.35,38.8 | v6.1,3.81 6.86,3.05 14.22,3.05 14.79,3.61 Q0.2 | v44.7,3.56 44.7,5.28 Q1.2 | 24.77,52.32 24.77,57.8 25.4,58.42 POWER.2 | U7.3 22.21,54.89 24.77,52.32 | 38.35,38.8 37.91,38.35 v37.59,38.35
VEXC_0  (via drill 0.35)
  Top 0.152: LC_0.1 10.82,46.83 11.81,45.85 IC1.4 17.02,45.85 17.27,46.1 v17.27,47.24 17.27,47.12 IC1.14 | v16.91,52.32 15.24,53.99 15.24,62.74 15.81,63.31 R7.1
  Bottom 0.152: v17.27,47.24 16.76,47.24 16.33,47.68 16.33,51.74 v16.91,52.32
VEXC_1  (via drill 0.35)
  Top 0.152: LC_1.1 44.55,43.08 43.05,44.58 IC2.4 34.67,44.58 v34.54,44.7 34.54,43.34 34.51,43.31 IC2.14 | v34.54,58.42 32.45,58.42 R6.1
  Bottom 0.152: v34.54,44.7 v34.54,58.42
VNEG_0
  Top 0.152: IC1.7 12.57,42.04 10.28,44.33 LC_0.3
VNEG_1
  Top 0.152: LC_1.3 45.47,44.96 43.53,44.96 43.31,45.19 39.32,45.19 38.93,45.57 38.93,47.23 37.77,48.39 IC2.7
VOUT_0  (via drill 0.35)
  Top 0.152: IC1.11 IC1.10 17.65,42.04 v17.53,41.91 | R10.1 10.92,32.58 v10.92,34.04
  Bottom 0.152: v10.92,34.04 12.74,35.85 13.21,35.85 17.53,40.17 v17.53,41.91
VOUT_1  (via drill 0.35)
  Top 0.152: IC2.10 IC2.11 30.61,47.12 30.23,46.74 30.23,40.89 29.97,40.64 v29.72,40.64 | R12.2 9.97,19.56 v9.4,19.56
  Bottom 0.152: v9.4,19.56 8.64,20.32 8.64,30.73 19,41.1 29.52,41.1 29.72,40.89 v29.72,40.64
VPLUS_0
  Top 0.152: IC1.6 11.81,43.31 9.54,45.58 LC_0.2
VPLUS_1
  Top 0.152: LC_1.2 43.73,44.33 43.18,44.88 39.19,44.88 38.63,45.45 38.63,46.74 38.25,47.12 IC2.6
(copper drawn outside any net)
  shapes: Top area x2

### Text on the board
tNames: ~"Per Aspera / Ad Astra" | 100nF | 22kΩ | Zachary / Fuge / V1.3 | 15nF | 82kΩ | 39kΩ | 22kΩ | 3.3V | PE3 | PA6 | PA7
bNames: 100Ω | 560pF